# EAGLE schematic hacker-boards-refactor (EAGLE 7.5.0)
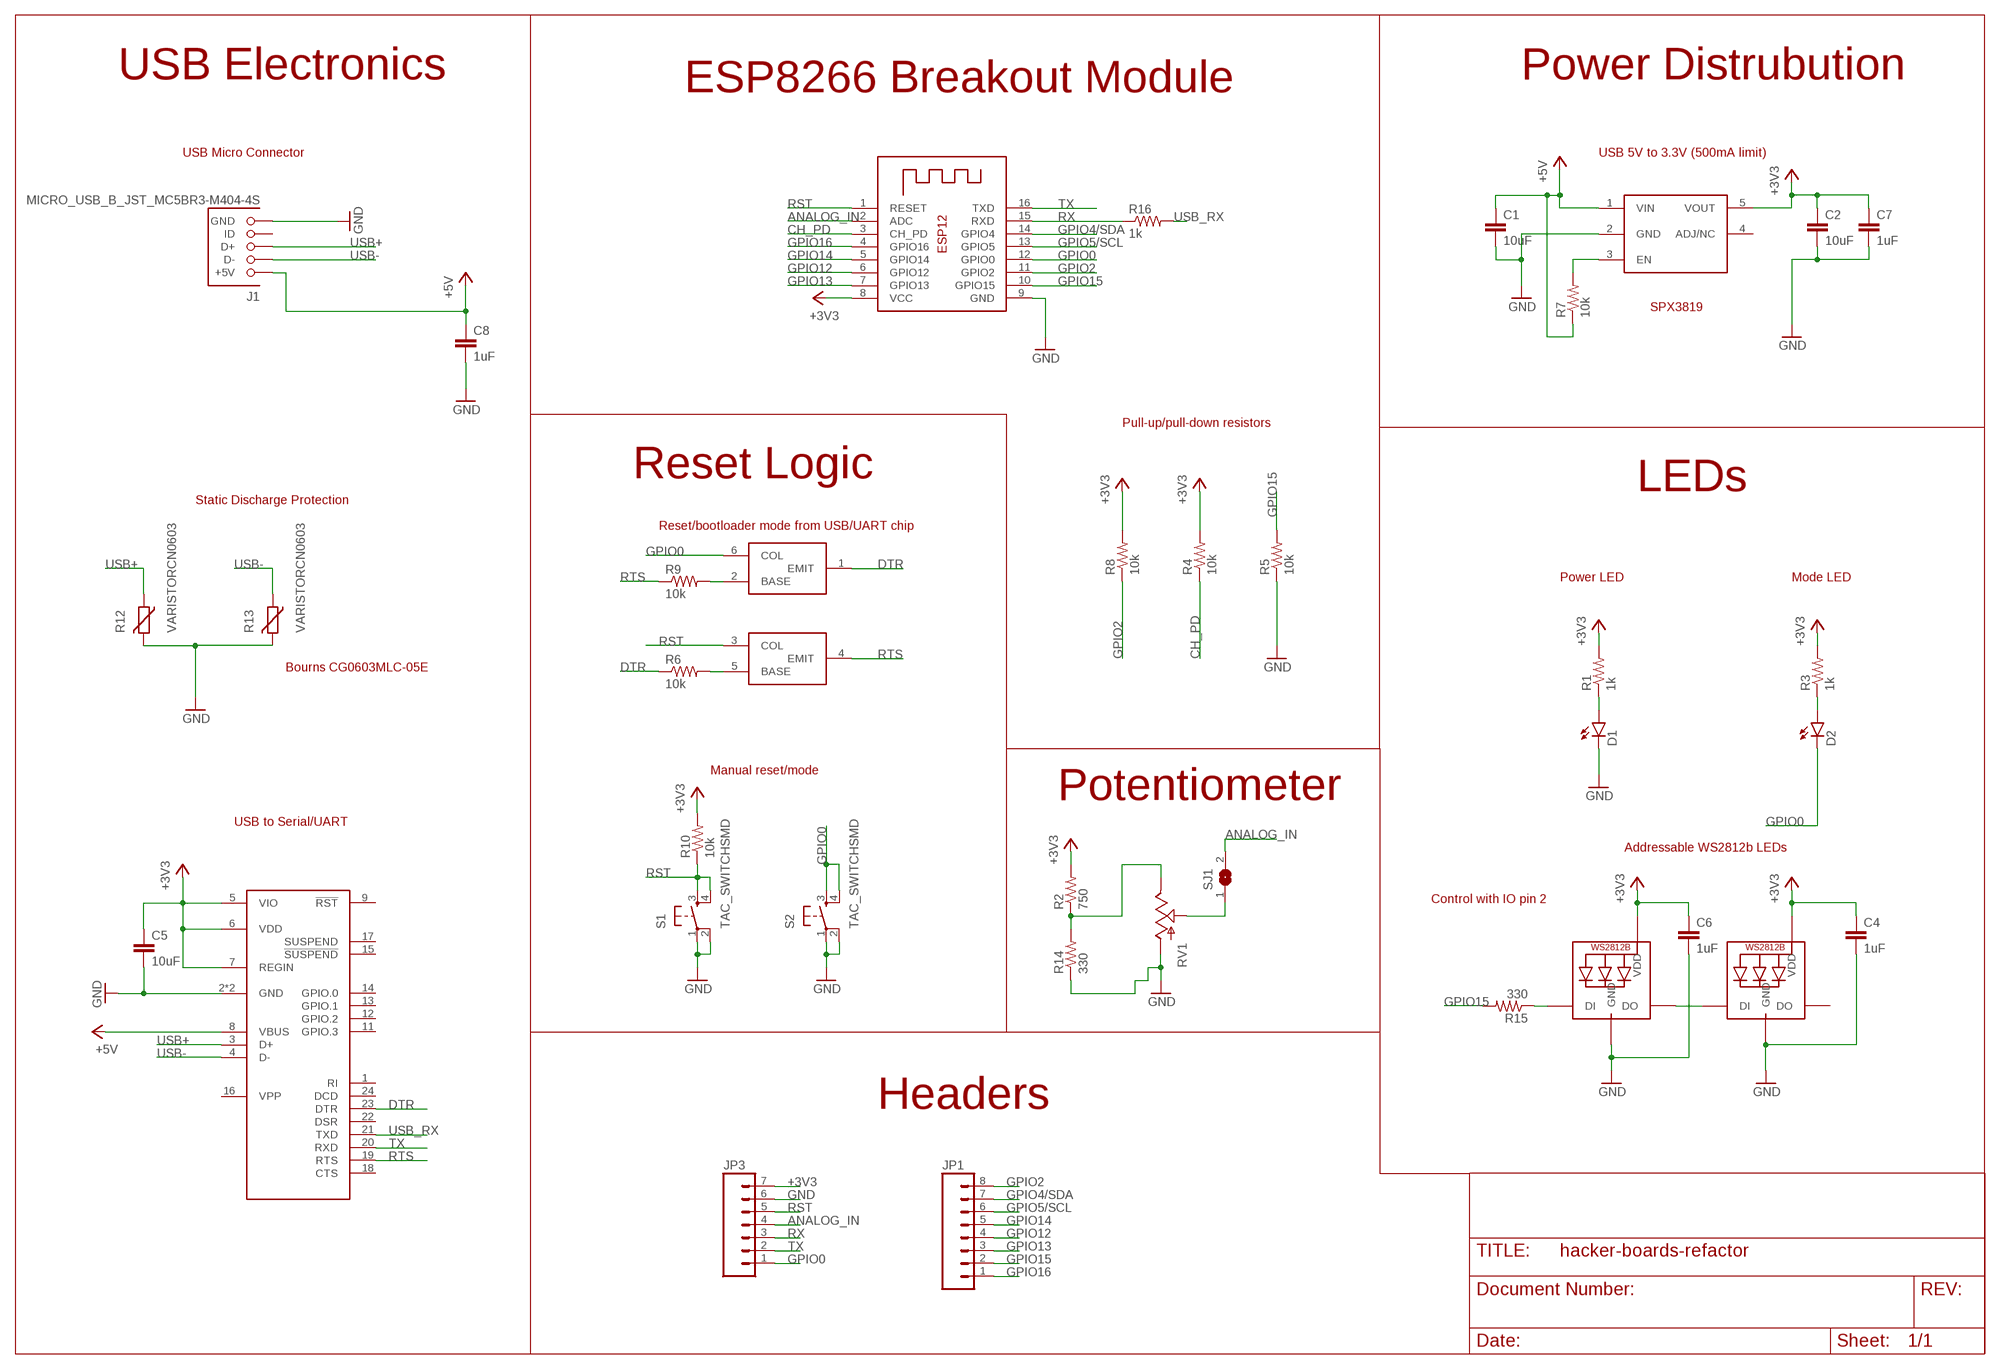
[diagram p0: schematic, sheet 1]

## Parts
C1  10uF  C0805  [C0805]
C2  10uF  C0805  [C0805]
C4  1uF  C-EUC0402  [C0402]
C5  10uF  C0805  [C0805]
C6  1uF  C-EUC0402  [C0402]
C7  1uF  C-EUC0402  [C0402]
C8  1uF  C-EUC0402  [C0402]
D1  LED0603  [LED-0603]
D2  LED0603  [LED-0603]
J1  MICRO_USB_B_JST_MC5BR3-M404-4S  [USB_MICRO_B-JST-MC5BR3-M404-4S-TB]
JP1  M08  [1X08_ROUND]
JP3  M07  [1X07]
LED1  WS2812B5050  [WS2812B]
LED2  WS2812B5050  [WS2812B]
R1  1k  R-US_R0402  [R0402]
R2  750  R-US_R0402  [R0402]
R3  1k  R-US_R0402  [R0402]
R4  10k  R-US_R0402  [R0402]
R5  10k  R-US_R0402  [R0402]
R6  10k  R-US_R0402  [R0402]
R7  10k  R-US_R0402  [R0402]
R8  10k  R-US_R0402  [R0402]
R9  10k  R-US_R0402  [R0402]
R10  10k  R-US_R0402  [R0402]
R12  VARISTORCN0603  [CT/CN0603]
R13  VARISTORCN0603  [CT/CN0603]
R14  330  R-US_R0402  [R0402]
R15  330  R-US_R0402  [R0402]
R16  1k  R-US_R0402  [R0402]
RV1  POTALPS-KIT  [ALPS_POT_KIT]
S1  TAC_SWITCHSMD  [TACTILE-SWITCH-SMD]
S2  TAC_SWITCHSMD  [TACTILE-SWITCH-SMD]
SJ1  SJ  [SJ]
U$2  AP2112  [SOT23-5L]
U$3  CP2104  [QFN24_4X4]
U$4  MBT3904DW1T1G  [SOT363]
X1  ESP-12  [ESP-12]

## Nets
+3V3: C2.1 C4.1 C5.1 C6.1 C7.1 JP3.7 LED1.1-VDD(VDD) LED2.1-VDD(VDD) R1.2 R2.2 R3.2 R4.2 R8.2 R10.2 U$2.5(VOUT) U$3.5(VIO) U$3.6(VDD) U$3.7(REGIN) X1.8(VCC)
+5V: C1.1 C8.1 J1.1(+5V) R7.1 U$2.1(VIN) U$3.8(VBUS)
ANALOG_IN: JP3.4 SJ1.2 X1.2(ADC)
CH_PD: R4.1 X1.3(CH_PD)
DTR: R6.1 U$3.23(DTR) U$4.1(EMIT)
GND: C1.2 C2.2 C4.2 C5.2 C6.2 C7.2 C8.2 D1.C J1.5(GND) JP3.6 LED1.3-GND(GND) LED2.3-GND(GND) R5.1 R12.2 R13.2 R14.1 RV1.P$3(A) S1.1 S1.2 S2.1 S2.2 U$2.2(GND) U$3.2(GND) U$3.25(GND) X1.9(GND)
GPIO0: D2.C JP3.1 S2.3 S2.4 U$4.6(COL) X1.12(GPIO0)
GPIO2: JP1.8 R8.1 X1.11(GPIO2)
GPIO4/SDA: JP1.7 X1.14(GPIO4)
GPIO5/SCL: JP1.6 X1.13(GPIO5)
GPIO12: JP1.4 X1.6(GPIO12)
GPIO13: JP1.3 X1.7(GPIO13)
GPIO14: JP1.5 X1.5(GPIO14)
GPIO15: JP1.2 R5.2 R15.2 X1.10(GPIO15)
GPIO16: JP1.1 X1.4(GPIO16)
N$1: D1.A R1.1
N$3: D2.A R3.1
N$4: R2.1 R14.2 RV1.P$1(E)
N$5: LED1.2-DOUT(DO) LED2.4-DIN(DI)
N$6: LED1.4-DIN(DI) R15.1
N$7: R7.2 U$2.3(EN)
N$8: R9.2 U$4.2(BASE)
N$11: R6.2 U$4.5(BASE)
N$12: RV1.P$2(S) SJ1.1
RST: JP3.5 R10.1 S1.3 S1.4 U$4.3(COL) X1.1(RESET)
RTS: R9.1 U$3.19(RTS) U$4.4(EMIT)
RX: JP3.3 R16.1 X1.15(RXD)
TX: JP3.2 U$3.20(RXD) X1.16(TXD)
USB+: J1.3(D+) R12.1 U$3.3(D+)
USB-: J1.2(D-) R13.1 U$3.4(D-)
USB_RX: R16.2 U$3.21(TXD)
Unconnected: J1.4(ID) LED2.2-DOUT(DO) U$2.4(ADJ/NC) U$3.1(RI) U$3.9(!RST) U$3.11(GPIO.3) U$3.12(GPIO.2) U$3.13(GPIO.1) U$3.14(GPIO.0) U$3.15(!SUSPEND) U$3.16(VPP) U$3.17(SUSPEND) U$3.18(CTS) U$3.22(DSR) U$3.24(DCD)

## Notes on the sheet
- USB Electronics | Power Distrubution
- ESP8266 Breakout Module
- USB Micro Connector | USB 5V to 3.3V (500mA limit)
- SPX3819
- Pull-up/pull-down resistors
- Reset Logic
- LEDs
- Static Discharge Protection
- Reset/bootloader mode from USB/UART chip
- Power LED | Mode LED
- Bourns CG0603MLC-05E
- Manual reset/mode
- Potentiometer
- USB to Serial/UART
- Addressable WS2812b LEDs
- Control with IO pin 2
- Headers

## Library data of the parts
C1 C2 C5 = hacker-board:C
C4 C6-C8 = resistor:C-EU: CAPACITOR, European symbol
D1 D2 = hacker-board:LED: LEDs Standard schematic elements and footprints for 5mm, 3mm, 1206, and 0603 sized LEDs. 5mm - Spark Fun Electronics SKU : COM-00529 (and others)
J1 = hacker-board:MICRO_USB_B_JST_MC5BR3-M404-4S: Micro USB B mid mount; DIGIKEY: 455-2567-2-ND; MOUSER: 53X3655
JP1 = SparkFun-Connectors:M08: Header 8 Standard 8-pin 0.1" header. Use with straight break away headers (SKU : PRT-00116), right angle break away headers (PRT-00553), swiss pins (PRT-00743), machine pins (PRT-00117), and female headers (PRT-00115).; PROD_ID: CONN-08437
JP3 = SparkFun-Connectors:M07: Header 7 Standard 7-pin 0.1" header. Use with straight break away headers (SKU : PRT-00116), right angle break away headers (PRT-00553), swiss pins (PRT-00743), machine pins (PRT-00117), and female headers (PRT-00115). NOTES ON THE VARIANTS LOCK and LOCK_LONGPADS... This footprint was designed to help hold the alignment of a through-hole component (i.e. 7-pin header) while soldering it into place. You may notice that each hole has been shifted either up or down by 0.005 of an inch from it's more standard position (which is usually a perfectly straight line). This slight alteration caused the pins (the squares in the middle) to touch the edges of the holes. Because they are alternating, it causes a "brace" to hold the header in place. 0.005 has proven to be the perfect amount of "off-center" position when using our standard breakaway headers. Although looks a little odd when you look at the bare footprint, once you have a header in there, the alteration is very hard to notice. Also, if you push a header all the way into place, it is covered up entirely on the bottom side. This idea of altering the position of holes to aid alignment will be further integrated into the Sparkfun Library for other footprints. It can help hold any component with 3 or more connection pins.
LED1 LED2 = hacker-board:WS2812B
R1-R10 R14-R16 = resistor:R-US_: RESISTOR, American symbol
R12 R13 = varistor:VARISTOR: VARISTOR
RV1 = SparkFun-Electromechanical:POT; PROD_ID: RES-09177
S1 S2 = hacker-board:TAC_SWITCH: Momentary Switch Button commonly used for reset or general input. Spark Fun Electronics SKU : COM-00097 SMT- SWCH-08247; PROD_ID: SWCH-08247
SJ1 = jumper:SJ: SMD solder JUMPER
U$2 = hacker-board:AP2112
U$3 = hacker-board:CP2104
U$4 = hacker-board:MBT3904DW1T1G
X1 = hacker-board:ESP-12

## Net classes
0 default: width 0.203 mm, drill 0.406 mm